# EAGLE design untitled (EAGLE 6.5.0)
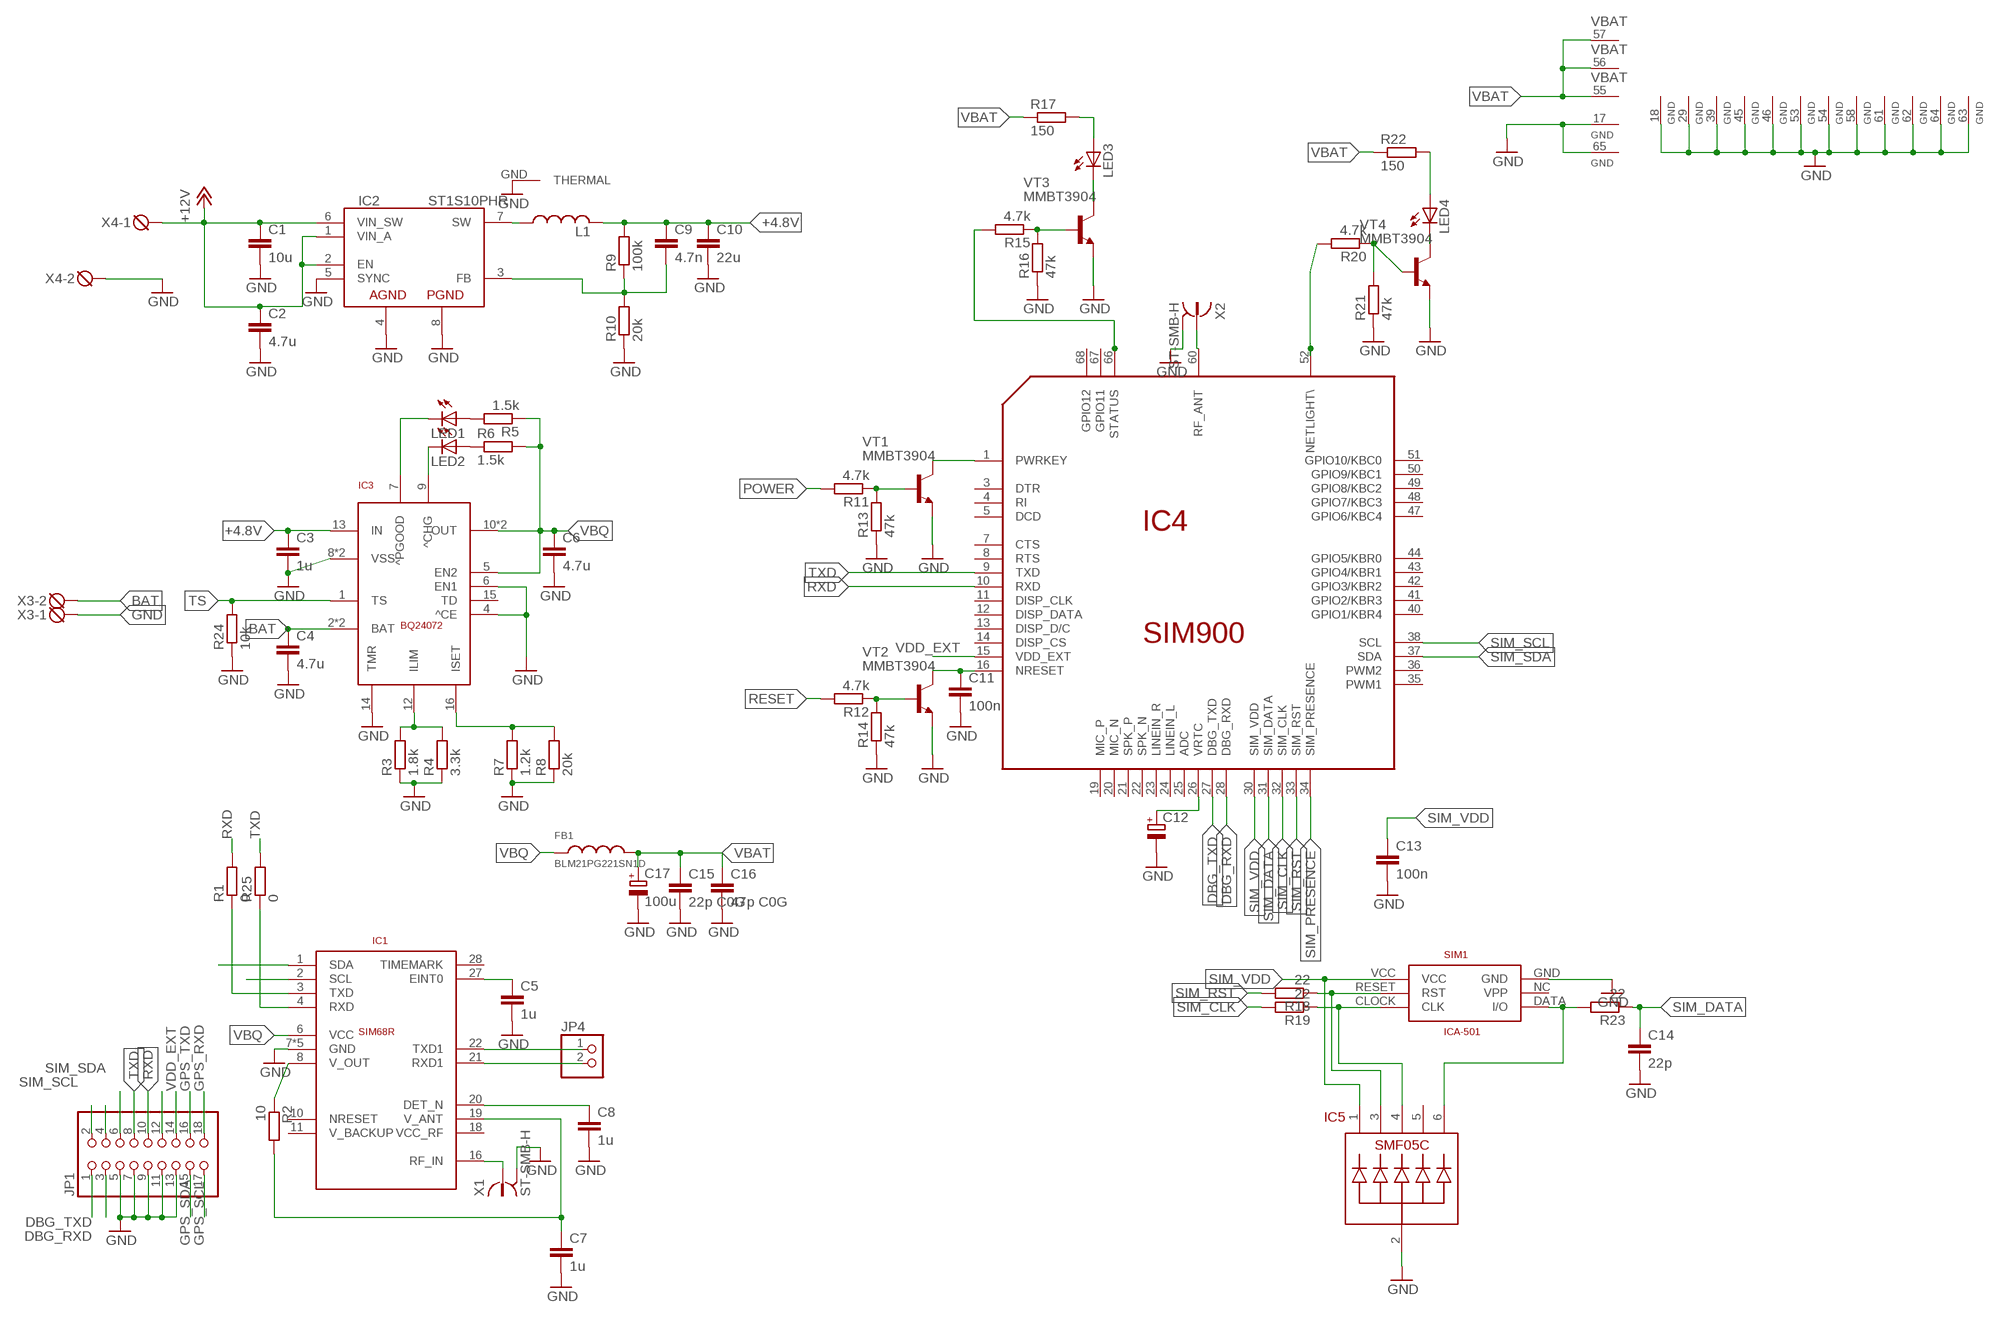
[diagram p0: schematic, sheet 1]

## Parts
C1  10u  C-EUC0805  [C0805]
C2  4.7u  C-EUC0805  [C0805]
C3  1u  C-EUC0805  [C0805]
C4  4.7u  C-EUC0805  [C0805]
C5  1u  C-EUC0805  [C0805]
C6  4.7u  C-EUC0805  [C0805]
C7  1u  C-EUC0805  [C0805]
C8  1u  C-EUC0805  [C0805]
C9  4.7n  C-EUC0805  [C0805]
C10  22u  C-EUC0805  [C0805]
C11  100n  C-EUC0805  [C0805]
C12  CPOL-EUA/3216-18R  [A/3216-18R]
C13  100n  C-EUC0805  [C0805]
C14  22p  C-EUC0805  [C0805]
C15  22p C0G  C-EUC0805  [C0805]
C16  47p C0G  C-EUC0805  [C0805]
C17  100u  CPOL-EUB/3528-21W  [B/3528-21W]
FB1  BLM21PG221SN1D  BLM21PG221  [R0805]
IC1  SIM68R  [SIM68]
IC2  ST1S10PHR  [HSOP8]
IC3  BQ24072  [QFN16]
IC4  SIM900  [SIM900]
IC5  SMF05C  [SC-70-6]
JP1  PINHD-2X9  [2X09]
JP4  PINHD-1X2ROUND  [1X02ROUND]
L1  INDUCTOR-SUMIDA-CDRH4D18  [INDUCTOR-SUMIDA-CDRH4D18]
LED1  LED0805  [SML0805]
LED2  LED0805  [SML0805]
LED3  LED0805  [SML0805]
LED4  LED0805  [SML0805]
R1  0  R-EU_R0805  [R0805]
R2  10  R-EU_R0805  [R0805]
R3  1.8k  R-EU_R0805  [R0805]
R4  3.3k  R-EU_R0805  [R0805]
R5  1.5k  R-EU_R0603  [R0603]
R6  1.5k  R-EU_R0603  [R0603]
R7  1.2k  R-EU_R0603  [R0603]
R8  20k  R-EU_R0805  [R0805]
R9  100k  R-EU_R0805  [R0805]
R10  20k  R-EU_R0805  [R0805]
R11  4.7k  R-EU_R0805  [R0805]
R12  4.7k  R-EU_R0805  [R0805]
R13  47k  R-EU_R0805  [R0805]
R14  47k  R-EU_R0805  [R0805]
R15  4.7k  R-EU_R0805  [R0805]
R16  47k  R-EU_R0805  [R0805]
R17  150  R-EU_R0805  [R0805]
R18  22  R-EU_R0805  [R0805]
R19  22  R-EU_R0805  [R0805]
R20  4.7k  R-EU_R0805  [R0805]
R21  47k  R-EU_R0805  [R0805]
R22  150  R-EU_R0805  [R0805]
R23  22  R-EU_R0805  [R0805]
R24  10k  R-EU_R0805  [R0805]
R25  0  R-EU_R0805  [R0805]
SIM1  ICA-501  [ICA-501-006-F7]
VT1  MMBT3904  [SOT23-BCE]
VT2  MMBT3904  [SOT23-BCE]
VT3  MMBT3904  [SOT23-BCE]
VT4  MMBT3904  [SOT23-BCE]
X1  ST-SMB-H  [ST-SMB-H]
X2  ST-SMB-H  [ST-SMB-H]
X3  DG3XX-02-5.0  [DG306-5.0-02P]
X4  DG3XX-02-5.0  [DG306-5.0-02P]

## Nets
+4.8V: C3.1 C9.1 C10.1 IC3.13(IN) L1.P$2 R9.2
+12V: C1.1 C2.1 IC2.1(VIN_A) IC2.2(EN) IC2.6(VIN_SW) X4.1
BAT: C4.1 IC3.2(BAT) IC3.3(BAT) X3.2
DBG_RXD: IC4.28(DBG_RXD) JP1.3
DBG_TXD: IC4.27(DBG_TXD) JP1.1
GND: C1.2 C2.2 C3.2 C4.2 C5.2 C6.2 C7.2 C8.2 C10.2 C11.2 C12.- C13.2 C14.2 C15.2 C16.2 C17.- IC1.7(GND) IC1.13(GND) IC1.14(GND) IC1.15(GND) IC1.17(GND) IC2.4(AGND) IC2.5(SYNC) IC2.8(PGND) IC2.GND(THERMAL) IC3.4(^CE) IC3.6(EN1) IC3.8(VSS) IC3.14(TMR) IC3.TH(VSS) IC4.17(GND) IC4.18(GND) IC4.29(GND) IC4.39(GND) IC4.45(GND) IC4.46(GND) IC4.53(GND) IC4.54(GND) IC4.58(GND) IC4.61(GND) IC4.62(GND) IC4.63(GND) IC4.64(GND) IC4.65(GND) IC5.2 JP1.5 JP1.7 JP1.9 JP1.11 JP1.13 R3.1 R4.1 R7.1 R8.1 R10.1 R13.1 R14.1 R16.1 R21.1 R24.1 SIM1.GND VT1.E VT2.E VT3.E VT4.E X1.2 X1.3 X1.4 X1.5 X2.2 X2.3 X2.4 X2.5 X3.1 X4.2
GPS_RXD: IC1.4(RXD) JP1.18 R25.1
GPS_SCL: IC1.2(SCL) JP1.17
GPS_SDA: IC1.1(SDA) JP1.15
GPS_TXD: IC1.3(TXD) JP1.16 R1.1
N$1: IC2.7(SW) L1.P$1
N$2: C11.1 IC4.16(NRESET) VT2.C
N$3: C9.2 IC2.3(FB) R9.1 R10.2
N$4: LED2.A R6.1
N$5: IC3.16(ISET) R7.2 R8.2
N$6: IC3.12(ILIM) R3.2 R4.2
N$7: LED1.A R5.2
N$8: IC3.9(^CHG) LED2.C
N$9: IC3.7(^PGOOD) LED1.C
N$10: IC4.1(PWRKEY) VT1.C
N$11: R11.1 R13.2 VT1.B
N$12: R12.1 R14.2 VT2.B
N$13: IC4.60(RF_ANT) X2.1
N$14: IC5.3 R18.1 SIM1.RESET(RST)
N$15: IC5.6 R23.2 SIM1.DATA(I/O)
N$16: LED4.C VT4.C
N$17: C12.+ IC4.26(VRTC)
N$18: IC5.4 R19.1 SIM1.CLOCK(CLK)
N$19: R20.1 R21.2 VT4.B
N$20: IC4.52(NETLIGHT\) R20.2
N$22: IC1.8(V_OUT) R2.1
N$23: C7.1 IC1.19(V_ANT) R2.2
N$24: IC1.16(RF_IN) X1.1
N$25: IC1.22(TXD1) JP4.1
N$26: C8.1 IC1.20(DET_N)
N$27: C5.1 IC1.27(EINT0)
N$32: IC1.21(RXD1) JP4.2
N$35: R15.1 R16.2 VT3.B
N$36: LED3.A R17.2
N$37: LED3.C VT3.C
N$38: IC4.66(STATUS) R15.2
N$45: LED4.A R22.2
POWER: JP1.12 R11.2
RESET: JP1.6 R12.2
RXD: IC4.10(RXD) JP1.10 R1.2
SIM_CLK: IC4.32(SIM_CLK) R19.2
SIM_DATA: C14.1 IC4.31(SIM_DATA) R23.1
SIM_PRESENCE: IC4.34(SIM_PRESENCE)
SIM_RST: IC4.33(SIM_RST) R18.2
SIM_SCL: IC4.38(SCL) JP1.2
SIM_SDA: IC4.37(SDA) JP1.4
SIM_VDD: C13.1 IC4.30(SIM_VDD) IC5.1 SIM1.VCC
TS: IC3.1(TS) R24.2
TXD: IC4.9(TXD) JP1.8 R25.2
VBAT: C15.1 C16.1 C17.+ FB1.2 IC4.55(VBAT) IC4.56(VBAT) IC4.57(VBAT) R17.1 R22.1
VBQ: C6.1 FB1.1 IC1.6(VCC) IC3.5(EN2) IC3.10(OUT) IC3.11(OUT) R5.1 R6.2
VDD_EXT: IC4.15(VDD_EXT) JP1.14
Unconnected: IC1.10(NRESET) IC1.11(V_BACKUP) IC1.18(VCC_RF) IC1.28(TIMEMARK) IC3.15(TD) IC4.3(DTR) IC4.4(RI) IC4.5(DCD) IC4.7(CTS) IC4.8(RTS) IC4.11(DISP_CLK) IC4.12(DISP_DATA) IC4.13(DISP_D/C) IC4.14(DISP_CS) IC4.19(MIC_P) IC4.20(MIC_N) IC4.21(SPK_P) IC4.22(SPK_N) IC4.23(LINEIN_R) IC4.24(LINEIN_L) IC4.25(ADC) IC4.35(PWM1) IC4.36(PWM2) IC4.40(GPIO1/KBR4) IC4.41(GPIO2/KBR3) IC4.42(GPIO3/KBR2) IC4.43(GPIO4/KBR1) IC4.44(GPIO5/KBR0) IC4.47(GPIO6/KBC4) IC4.48(GPIO7/KBC3) IC4.49(GPIO8/KBC2) IC4.50(GPIO9/KBC1) IC4.51(GPIO10/KBC0) IC4.67(GPIO11) IC4.68(GPIO12) IC5.5 SIM1.NC(VPP)

## Power pins joined to a net without a drawn wire
GND: IC4.59(GND)

## Library data of the parts
C1-C11 C13-C16 = resistor:C-EU: CAPACITOR, European symbol
C12 C17 = rcl:CPOL-EU: POLARIZED CAPACITOR, European symbol
FB1 = murata-ferrite:BLM21PG221
IC1 = sim68:SIM68R
IC2 = vreg-pulse (1):ST1S10: 3 A, 900 kHz, monolithic synchronous step-down regulator
IC3 = TI-bq24075:BQ24072
IC4 = sim900R:SIM900
IC5 = smf05c:SMF05C
JP1 = pinhead:PINHD-2X9: PIN HEADER
JP4 = pinhead:PINHD-1X2: PIN HEADER
L1 = CDRH6D38:INDUCTOR-SUMIDA-CDRH4D18
LED1-LED4 = LED0805:LED0805
R1-R25 = rcl:R-EU_: RESISTOR, European symbol
SIM1 = ICA-501:ICA-501
VT1-VT4 = transistor-npn:MMBT3904
X1 X2 = coaxCon:ST-SMB-H: MALE SMB CONNECTOR Radiall distributor RS 193-8861887; OC_FARNELL: unknown; OC_NEWARK: unknown
X3 X4 = degson:DG3XX-02: DG350-3.5-02P DG306-5.0-02P

## Board
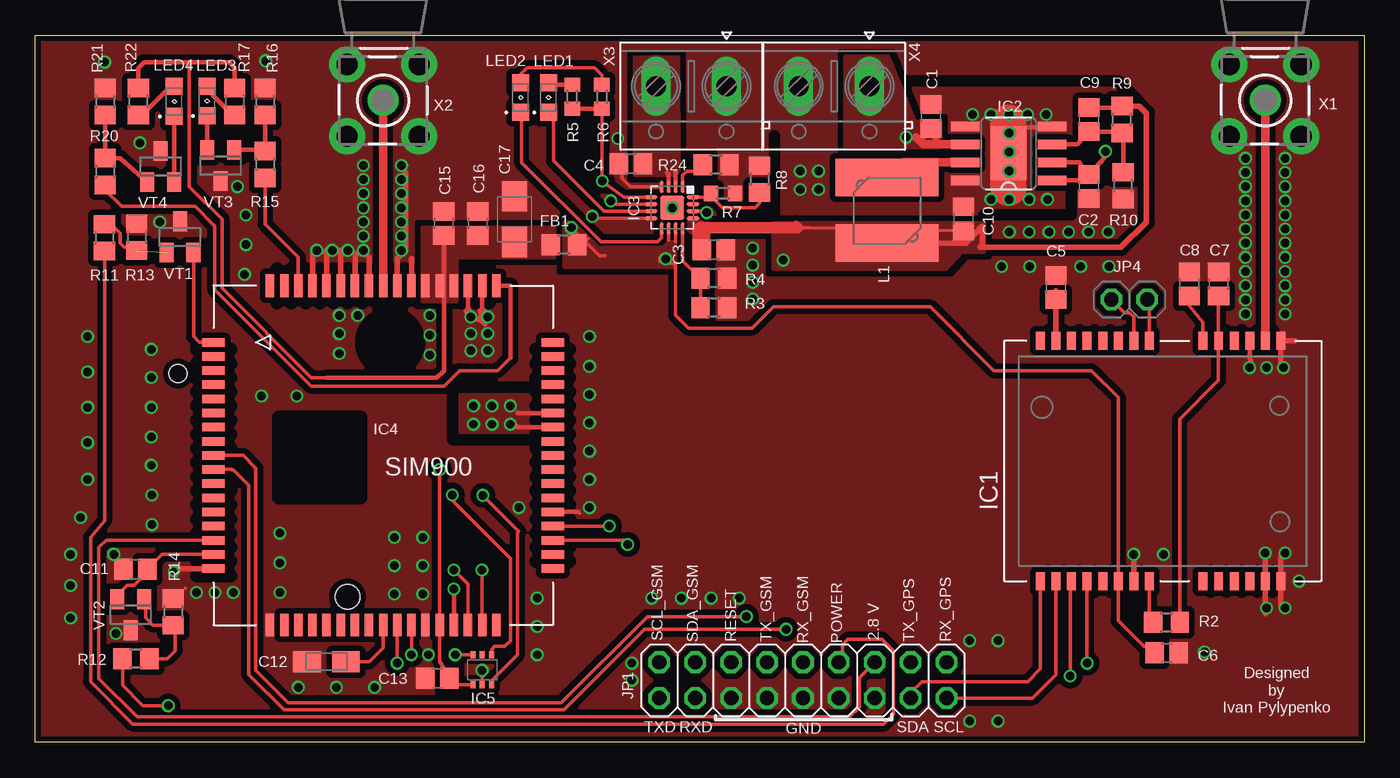
[diagram p1: board, top side]
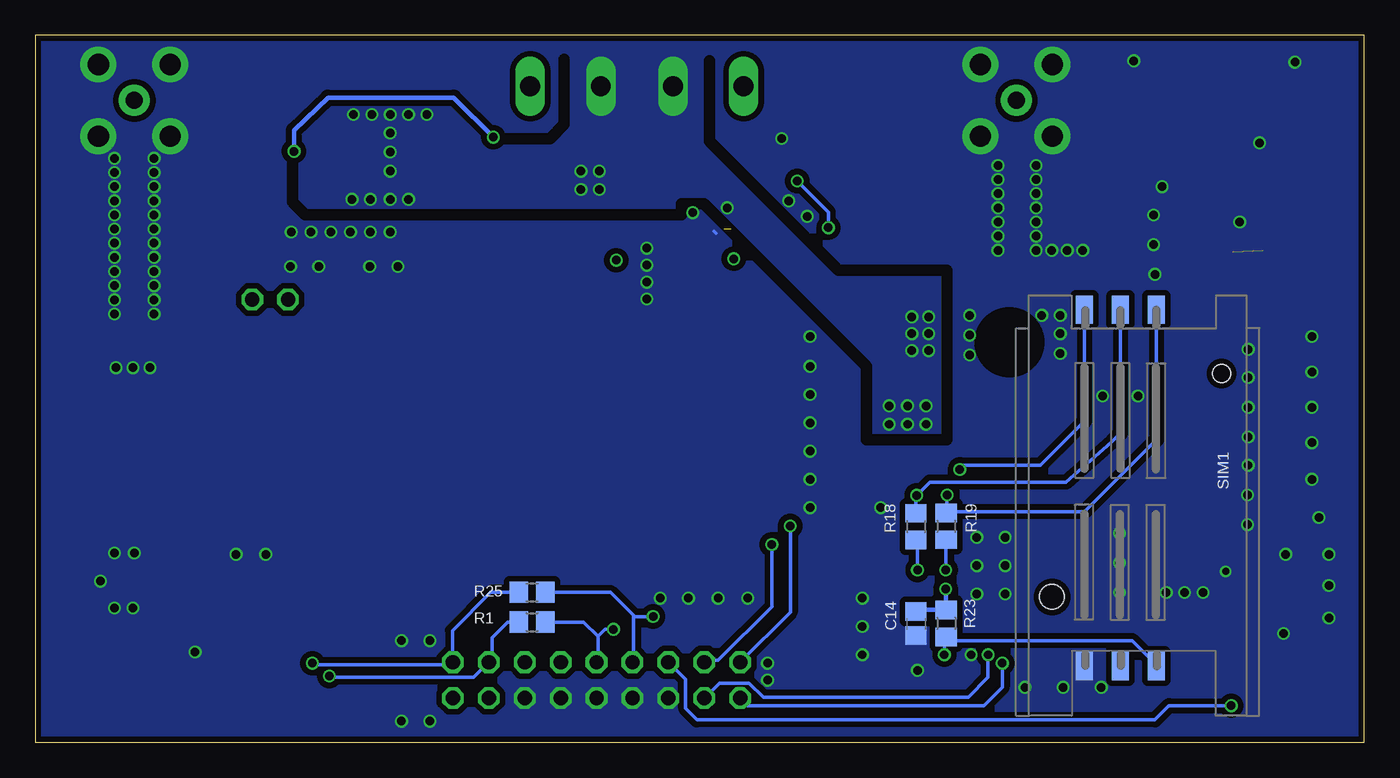
[diagram p2: board, bottom side, seen from below]

Size 94 x 50 mm. Coordinates in mm from the lower left corner, seen from the top.
Outline: 0,0 0,50 94,50 94,0 0,0
Copper layers (1*16): Top 0.035mm / dielectric 1.5mm / Bottom 0.035mm
Design rules "ITEADstudio_DRC": minimum track width 6mil, minimum drill 12mil, track to track 6mil, track to pad 6mil, pad to pad 6mil, via to via 6mil, smd to smd 0mil, copper to edge 10mil, drill to drill 10mil, minimum pad ring 10mil, minimum via ring 6mil, stop-mask expansion 2mil, vias tented up to drill 100mil, thermal gap 10mil
tRestrict: 8 lines
bRestrict: 16 lines

### Footprints (pad centres in the part's own frame; a part is rotated, then mirrored left to right if it is on the bottom)
C0805 = smd 1.3 x 1.5: 1 -0.85,0; 2 0.85,0
A/3216-18R = smd 1.95 x 1.5: + 1.375,0; - -1.375,0
B/3528-21W = smd 2.15 x 1.8: + 1.625,0; - -1.625,0
R0805 = smd 1.3 x 1.5: 1 -0.95,0; 2 0.95,0
SIM68 = smd 1.27 x 0.635: 1 0,0; 2 0,-1.1; 3 0,-2.2; 4 0,-3.3; 5 0,-4.4; 6 0,-5.5; 7 0,-6.6; 8 0,-7.7; 9 0,-11.5; 10 0,-12.6; 11 0,-13.7; 12 0,-14.8; 13 0,-15.9; 14 0,-17; 15 17,-17; 16 17,-15.9; 17 17,-14.8; 18 17,-13.7; 19 17,-12.6; 20 17,-11.5; 21 17,-7.7; 22 17,-6.6; 23 17,-5.5; 24 17,-4.4; 25 17,-3.3; 26 17,-2.2; 27 17,-1.1; 28 17,0
HSOP8 = smd 0.66 x 2.032: 1 -1.905,-3.073; 2 -0.635,-3.073; 3 0.635,-3.073; 4 1.905,-3.073; 5 1.905,3.073; 6 0.635,3.073; 7 -0.635,3.073; 8 -1.905,3.073 | smd 3.81 x 2.54: GND 0,0
QFN16 = smd 0.85 x 0.28: 1 -1.475,0.75; 2 -1.475,0.25; 3 -1.475,-0.25; 4 -1.475,-0.75; 9 1.475,-0.75; 10 1.475,-0.25; 11 1.475,0.25; 12 1.475,0.75 | smd 0.28 x 0.85: 5 -0.75,-1.475; 6 -0.25,-1.475; 7 0.25,-1.475; 8 0.75,-1.475; 13 0.75,1.475; 14 0.25,1.475; 15 -0.25,1.475; 16 -0.75,1.475 | smd 1.7 x 1.7: TH 0,0
SIM900 = smd 1.6 x 0.6: 1 -12,8; 2 -12,7; 3 -12,6; 4 -12,5; 5 -12,4; 6 -12,3; 7 -12,2; 8 -12,1; 9 -12,0; 10 -12,-1; 11 -12,-2; 12 -12,-3; 13 -12,-4; 14 -12,-5; 15 -12,-6; 16 -12,-7; 17 -12,-8; 35 12,-8; 36 12,-7; 37 12,-6; 38 12,-5; 39 12,-4; 40 12,-3; 41 12,-2; 42 12,-1; 43 12,0; 44 12,1; 45 12,2; 46 12,3; 47 12,4; 48 12,5; 49 12,6; 50 12,7; 51 12,8 | smd 0.6 x 1.6: 18 -8,-12; 19 -7,-12; 20 -6,-12; 21 -5,-12; 22 -4,-12; 23 -3,-12; 24 -2,-12; 25 -1,-12; 26 0,-12; 27 1,-12; 28 2,-12; 29 3,-12; 30 4,-12; 31 5,-12; 32 6,-12; 33 7,-12; 34 8,-12; 52 8,12; 53 7,12; 54 6,12; 55 5,12; 56 4,12; 57 3,12; 58 2,12; 59 1,12; 60 0,12; 61 -1,12; 62 -2,12; 63 -3,12; 64 -4,12; 65 -5,12; 66 -6,12; 67 -7,12; 68 -8,12
SC-70-6 = smd 0.35 x 0.5: 1 -0.65,-1.05; 2 0,-1.05; 3 0.65,-1.05; 4 0.65,1.05; 5 0,1.05; 6 -0.65,1.05
2X09 = drill 1.016 octagon: 1 -10.16,-1.27; 2 -10.16,1.27; 3 -7.62,-1.27; 4 -7.62,1.27; 5 -5.08,-1.27; 6 -5.08,1.27; 7 -2.54,-1.27; 8 -2.54,1.27; 9 0,-1.27; 10 0,1.27; 11 2.54,-1.27; 12 2.54,1.27; 13 5.08,-1.27; 14 5.08,1.27; 15 7.62,-1.27; 16 7.62,1.27; 17 10.16,-1.27; 18 10.16,1.27
1X02ROUND = drill 1.016 octagon: 1 -1.27,0; 2 1.27,0
INDUCTOR-SUMIDA-CDRH4D18 = smd 7.3 x 2.65: P$1 0,-2.325; P$2 0,2.325
SML0805 = smd 1.2 x 1.2: A 1.05,0; C -1.05,0
R0603 = smd 1 x 1.1: 1 -0.85,0; 2 0.85,0
ICA-501-006-F7 = smd 2 x 1.2: CLOCK 0,0; DATA 25.2,0; GND 25.2,-5.08; NC 25.2,-2.54; RESET 0,-2.54; VCC 0,-5.08 | hole 1.3: 4.51,4.61 | hole 1.75: 20.31,-7.38
SOT23-BCE = smd 1 x 1.4: B -0.95,-1.1; C 0.95,-1.1; E 0,1.1
ST-SMB-H = drill 1.2 pad 2.184: 1 0,0 | drill 1.5 pad 2.54: 2 -2.54,2.54; 3 2.54,2.54; 4 2.54,-2.54; 5 -2.54,-2.54
DG306-5.0-02P = drill 1.4 long: 1 -2.5,0; 2 2.5,0

### Placement (x,y rotation side)
C1  63.36,44.27 90 top
C2  74.53,39.31 270 top
C3  48,34.84 0 top
C4  42.13,40.92 180 top
C5  72.19,32.17 90 top
C6  80.03,6.33 0 top
C7  83.69,32.41 90 top
C8  81.63,32.41 90 top
C9  74.53,44.05 270 top
C10  65.65,37.03 90 top
C11  7.08,12.25 180 top
C12  20.6,5.7 0 top
C13  28.44,4.54 180 top
C14  31.7,8.4 270 bottom
C15  28.9,36.7 90 top
C16  31.3,36.7 90 top
C17  33.9,37 270 top
FB1  37.4,35.2 180 top
IC1  71.1,11.4 90 top
IC2  68.85,41.65 90 top
IC3  45.05,37.82 270 top
IC4  24.61,20.3 0 top
IC5  31.61,5.14 0 top
JP1  54.3,4.4 0 top
JP4  77.39,31.32 0 top
L1  60.25,37.63 180 top
LED1  36.29,45.61 90 top
LED2  34.32,45.61 90 top
LED3  12.14,45.36 90 top
LED4  9.81,45.34 90 top
R1  58.86,8.51 0 bottom
R2  80.01,8.49 0 top
R3  48.01,30.74 180 top
R4  48,32.81 180 top
R5  37.98,45.66 90 top
R6  40.08,45.66 270 top
R7  48.65,38.83 180 top
R8  51.23,39.83 270 top
R9  76.87,44.05 90 top
R10  76.95,39.37 90 top
R11  4.89,35.69 270 top
R12  7.11,5.92 180 top
R13  7.17,35.73 270 top
R14  9.76,9.24 270 top
R15  16.25,40.88 270 top
R16  16.25,45.33 270 top
R17  14.1,45.33 270 top
R18  31.7,15.26 270 bottom
R19  29.57,15.29 270 bottom
R20  4.94,40.38 270 top
R21  4.93,45.33 270 top
R22  7.29,45.33 270 top
R23  29.57,8.41 270 bottom
R24  48.15,40.85 180 top
R25  58.86,10.61 0 bottom
SIM1  14.7,30.6 270 bottom
VT1  10.23,35.74 0 top
VT2  6.75,9.03 180 top
VT3  13.11,40.8 180 top
VT4  8.87,40.73 0 top
X1  87,45.4 90 top
X2  24.6,45.4 90 top
X3  46.4,46.4 180 top
X4  56.5,46.4 180 top

### Tracks (layer width: path | path; a pad name or v marks a point on that pad's centre or on a via)
+4.8V  (via drill 0.6)
  Top 0.254: 53.8,36.7 54.1,36.4 54.73,36.4 C10.1
  Top 0.305: C9.1 76.45,44.9 R9.2
  Top 0.406: 47.5,36.4 47.1,36.2 | 47.1,35.14 C3.1 | 53.8,36.7 53.9,36.4 | L1.P$2 65.81,35.31 67,36.5 67,35.2 66.8,35 76.8,35 78.6,36.8 78.6,44.5 78.1,45 R9.2
  Top 0.813: 53.9,36.4 47.5,36.4
  Top 1.27: 47.1,36.2 47.1,35.14
  other vias: 52.9,34.1
  pour Top (no thermals): 52.2,33.5 64.4,33.5 65.5,34.7 67.1,34.7 67.1,36.7 52.2,36.7
  pour Top (no thermals): 46.25,37.1 46.25,36.2 46.6,35.85 47.65,35.85 47.65,36.75 47.25,37.1
+12V  (via drill 0.6)
  Top 0.305: IC2.1 74.03,39.74 C2.1 | IC2.2 73.84,41.02 C2.1 | C2.1 74.61,40.28 74.7,40.2 | v61.6,42.8 62.3,42.8 62.84,42.8 C1.1 | v75.7,41.8 75.7,41.42 C2.1
  Top 0.406: 63.89,42.28 C1.1 | 74.7,40.2 74.6,40.2
  Top 0.61: IC2.6 62.81,42.28 62.3,42.8
  Bottom 0.305: v75.7,41.8 75.7,43.3 73.3,45.6 64.4,45.6 v61.6,42.8
  pour Top (no thermals): 64,42.1 57.3,42.1 57.3,48.5 60.3,48.5 62.2,43.9 64,43.9
BAT
  Top 0.305: IC3.3 44.8,40.2 44.7,40.3 | IC3.2 45.3,40.4
  pour Top (no thermals): 42.4,40.1 45.3,40.1 45.55,40.5 45.55,40.75 45.5,48.45 42.4,48.45
DBG_RXD  (via drill 0.6)
  Top 0.254: IC4.28 v26.61,6.21 v26.6,6.2
  Bottom 0.254: JP1.3 45.61,4.2 43.5,4.2 42.5,3.2 28,3.2 26.6,4.6 v26.6,6.2
DBG_TXD  (via drill 0.6)
  Top 0.254: IC4.27 v25.61,5.61 v25.6,5.6
  Bottom 0.254: v25.6,5.6 25.6,3.9 26.9,2.6 43.61,2.6 JP1.1
GND  (via drill 0.5, 0.6)
  Top 0.254: 47.5,37.6 47.47,37.57 v47.5,37.47 47.6,37.57 IC3.14 | IC3.4 42.11,39.29 41.5,39.9 41.5,40.84 C4.2 | IC3.8 39.93,37.07 v39.4,37.2 | IC3.6 40.93,38.07 v40.7,38.3 | 38.41,16.3 38.5,16.2 | IC5.2 31.61,4.92 31.9,5.2 | C12.- 19.48,5.7 SIM1.GND | 10.61,10.89 arc-45 10.6,10.9
  Top 0.305: 31.5,29.9 31,29.9 v30.8,30.1 30.61,30.3 IC4.54 | 71,43.5 69.1,43.5 68.9,43.7 | IC1.17 85.9,27.1 86,27 | IC4.46 34.1,23.3 | IC4.45 34.1,22.3 34,22.4 | IC4.53 31.61,30.5 | IC4.39 38.41,16.3
  Top 0.406: IC4.58 26.61,34.2 | 77.7,12.3 IC1.7 77.7,13.1 77.6,13.2 | 31.61,30.2 31.5,30.1 31.5,29.9 31.8,29.6 | IC4.65 19.61,34.51 19.8,34.7 20.61,34.7 | IC4.64 20.61,34.7 | 20.61,34.7 20.61,34.8 20.6,34.8 | IC4.63 21.61,34.7 21.5,34.8 | IC4.62 22.61,34.59 | 22.61,34.59 22.6,34.6 | IC4.59 25.61,34.2 26.2,34.8 26.2,40.32 | IC4.61 23.61,34.3 23.3,34.6 22.61,34.6 22.61,34.59 | 87,13.3 IC1.13 87,9.1 | 88.1,13.1 IC1.14 88.1,9.6 | 71,43.5 71.87,43.5 IC2.4 | 88,26.5 88.1,26.6 IC1.15 89.1,28.4 | IC4.17 9.8,12.29 v9.8,12.1
  Top 0.61: 30.61,30.5 v30.8,30.1 | 31.61,30.5 v32,30.1
  Top 2.54: 68.85,39.2 68.85,43.85
  Bottom 0.254: 45.85,36 46,36.15 | v40.7,38.3 40.6,38.3 40.5,38.4
  other vias: 8.25,17.5 8.25,15.4 68.9,40.4 68.9,41.75 68.9,43.1 17.3,14.8 11.4,10.6 17.3,12.7 14,10.6 12.7,10.6 77.7,13.3 27.4,12.5 25.4,12.5 25.4,10.5 27.4,10.5 8.2,25.8 8.2,23.7 8.2,21.6 8.2,19.6 8.2,27.8 50.75,34.95 50.75,33.75 39.2,18.6 39.2,20.6 67.6,38.4 68.9,38.4 45.05,37.8 68.9,36.1 70.3,36.1 71.7,36.1 73.1,36.1 74.5,36.1 75.9,36.1 70.3,38.4 68.9,44.4 67.6,44.4 70.2,44.4 30.8,28.9 32,28.9 55.4,39.1 71.6,38.4 55.4,40.4 7.4,42.4 14.9,35.2 14.9,37.3 14.8,33.1 41.2,42.7 31,22.5 32.3,22.5 33.6,22.5 33.6,23.8 32.3,23.8 31,23.8 30.8,27.7 32,27.7 23.2,34.8 23.2,35.8 23.2,36.8 23.2,37.8 23.2,38.8 25.9,34.8 25.9,35.8 25.9,36.8 25.9,37.8 25.9,38.8 22.1,34.8 21,34.8 19.9,34.8 8.8,36.8 5.7,7.7 31.6,5.1 27.8,6.2 50.75,32.55 50.75,31.35 85.6,40.3 85.6,41.3 85.6,35.3 85.6,36.3 85.6,37.3 85.6,38.3 85.6,39.3 85.6,30.3 85.6,31.3 85.6,32.3 85.6,33.3 85.6,34.3 88.4,40.3 88.4,41.3 88.4,35.3 88.4,36.3 88.4,37.3 88.4,38.3 88.4,39.3 88.4,30.3 88.4,31.3 88.4,32.3 88.4,33.3 88.4,34.3 88.4,9.5 88.4,13.4 87,13.4 79.8,13.3 85.9,26.5 87.1,26.5 88.3,26.5 23.2,39.8 23.2,40.8 25.9,39.8 25.9,40.8 39.2,16.6 34.2,16.6 35.5,6.2 35.5,8.2 35.5,10.2 17.3,10.6 87.1,9.5 5.55,13.3 3.7,26.2 3.7,23.7 3.7,18.6 3.7,21.2 3.2,15.9 2.5,13.3 2.5,11.1 2.5,8.8 54.1,40.4 54.1,39.1 66.3,44.4 71.5,44.4 18.6,3.9 21.3,3.9 24,3.9 39.2,22.6 39.2,24.6 39.2,26.6 39.2,28.7 82.7,6.4 4.9,48.1 16.3,48.2 14.3,39.3 66.1,7.2 68.1,7.2 43.6,10.2 45.7,10.2 47.8,10.2 49.8,10.2 68.1,1.5 66.1,1.5 70.35,33.65 68.35,33.65 73.95,33.65 75.95,33.65 21.5,30.2 27.9,30.2 16,24.5 18.5,24.5 3.7,28.7 89.4,11.4 42.2,5.6 42.2,4.4 22.8,30.2 21.5,28.9 21.5,27.5 27.9,27.4 27.9,28.8 25.4,14.5 27.4,14.5
  pour Top (isolate 0.406, rank 4, no thermals): 0,0 0,50.6 95.2,50.7 95.2,0
  pour Bottom (isolate 0.406, rank 4, no thermals): 0,0 0,50.6 95.2,50.7 95.2,0
  pour Top: 26,34.5 26,40.4 26.1,40.8 26.6,40.8 26.6,34.5
GPS_RXD  (via drill 0.6)
  Top 0.254: v74.4,5.6 IC1.4
  Bottom 0.254: R25.1 61.79,10.61 64.5,7.9 64.5,5.71 | 64.5,5.71 JP1.18 | 64.5,5.71 64.5,5.6 64.6,5.5 74.3,5.5 v74.4,5.6
GPS_SCL
  Top 0.254: JP1.17 70.53,3.13 72.2,4.8 IC1.2
GPS_SDA
  Top 0.254: JP1.15 61.92,3.52 62.7,4.3 70.2,4.3 71.1,5.2 IC1.1
GPS_TXD  (via drill 0.6)
  Top 0.254: v73.2,4.7 73.2,11.3 IC1.3
  Top 0.305: 73.4,11.5 IC1.3
  Bottom 0.254: R1.1 60.59,8.51 61.7,7.4 61.7,5.9 | 61.7,5.9 61.7,5.89 JP1.16 | 61.7,5.9 63,4.6 73.1,4.6 v73.2,4.7
N$1
  Top 0.61: IC2.7 61.43,41.02 L1.P$1
N$2
  Top 0.254: 8.29,11.89 C11.1 | VT2.C 5.8,10.2 5.88,10.2 5.88,10.48 6.5,11.1 7,11.1 7.5,11.6 7.5,11.81 C11.1 | IC4.16 8.98,13.29 C11.1
N$3
  Top 0.305: IC2.3 73.72,42.28 C9.2 76.55,43.2 R9.1 76.95,43.09 R10.2
N$4
  Top 0.254: R6.1 40.08,47.17 39.55,47.7 34.8,47.7 34.3,47.2 34.3,46.68 LED2.A
N$5
  Top 0.254: R8.2 51.23,38.13 50.9,37.8 48.6,37.8 48.1,38.3 48.1,38.53 R7.2 47.53,38.57 IC3.16
N$6
  Top 0.254: IC3.12 45.8,34.07 R4.2 R3.2
N$7
  Top 0.305: R5.2 36.44,46.51 LED1.A
N$8
  Top 0.254: IC3.9 44.3,35.7 44,35.4 40,35.4 34.4,41 34.4,44.48 LED2.C
N$9
  Top 0.254: LED1.C 36.65,44.2 36.65,41.15 40.23,37.57 IC3.7
N$10
  Top 0.254: VT1.C 11.19,28.71 11.6,28.3 IC4.1
N$11  (1 unrouted)
  Top 0.254: R11.1 5.36,36.64 6,36 6,35.3 6.3,35 6.95,35 R13.2
N$12
  Top 0.254: R12.1 9.32,5.92 9.9,6.5 9.9,8.15 R14.2 8.31,8.29 7.8,8.8 7.8,10.03 VT2.B
N$13
  Top 0.406: IC4.60
  Top 0.61: IC4.60 X2.1
N$14  (via drill 0.6)
  Top 0.254: 31.68,17.5 v31.65,17.48 34.2,14.93 34.1,14.83 34.1,6.2 32.27,4.37 IC5.3
  Bottom 0.254: R18.1 31.7,17.43 v31.65,17.48 30.73,18.4 21.1,18.4 17.84,21.26 17.24,21.86 SIM1.RESET
N$15  (via drill 0.6)
  Top 0.254: IC5.6 v29.7,6.2
  Bottom 0.254: SIM1.DATA 15.3,6.1 16.4,7.2 29.3,7.2 R23.2 29.7,7.33 v29.7,6.2
N$16
  Top 0.305: VT4.C LED4.C
N$17
  Top 0.254: IC4.26 24.61,6.71 23.6,5.7 C12.+
N$18  (via drill 0.6)
  Top 0.254: IC5.4 32.27,6.57 32.5,6.8 33.2,6.8 33.6,7.2 33.6,13 29.5,17.1 v29.5,17.5
  Bottom 0.254: 29.5,16.3 19.8,16.3 14.7,21.4 SIM1.CLOCK | 29.5,16.3 R19.1 | 29.5,16.3 v29.5,17.5
N$19
  Top 0.305: VT4.B 6.01,41.33 R20.1 R21.2
N$20
  Top 0.254: R20.2 4.94,39.06 6.1,37.9 11.3,37.9 12.63,36.57 arc-45 12.7,36.4 12.7,32 19.5,25.2 28.9,25.2 30,26.3 32.7,26.3 33.6,27.2
  Top 0.305: 33.6,27.2 33.6,32.3 IC4.52
N$22
  Top 0.254: IC1.8 78.8,8.75 R2.1
N$23
  Top 0.254: R2.2 80.96,22.86 83.7,25.6 IC1.19 C7.1
N$24
  Top 0.61: X1.1 IC1.16
N$25
  Top 0.254: IC1.22 77.7,30.1 77.4,30.4 77.04,30.4 JP4.1
N$26
  Top 0.254: C8.1 81.63,30.87 82.6,29.7 IC1.20
N$27
  Top 0.406: C5.1 72.2,31.92 IC1.27
N$32
  Top 0.254: IC1.21 78.8,30.66 JP4.2
N$35
  Top 0.305: VT3.B 16.18,41.9 R15.1 R16.2
N$36
  Top 0.305: R17.2 13.93,44.38 12.5,45.8 12.5,46.05 LED3.A
N$37
  Top 0.305: LED3.C 12.14,41.92 VT3.C
N$38
  Top 0.254: R15.2 16.25,36.65 18.6,34.3 IC4.66
N$45
  Top 0.305: LED4.A 9.59,46.38 8,44.8 7.71,44.8 R22.2
POWER
  Top 0.254: JP1.12 57.1,5.93 57.1,6.9 57.5,7.3 59.9,7.3 60.7,6.5 60.7,2 60,1.3 6.9,1.3 3.9,4.3 3.9,14.5 4.89,15.69 R11.2
RESET  (via drill 0.6)
  Top 0.254: R12.2 6.16,4.04 7.6,2.6 v9.4,2.6
  Bottom 0.254: JP1.6 48,4.45 48,2.4 47.2,1.6 14.8,1.6 13.8,2.6 v9.4,2.6
RXD  (via drill 0.6)
  Top 0.254: IC4.10 13.9,19.3 14,19.3 15.1,18.2 15.1,4.8 17.6,2.3 37.4,2.3 43.1,8 v53.1,8
  Bottom 0.254: R1.2 55.21,8.51 54.2,7.5 | 54.2,7.5 54.2,5.77 JP1.10 | v53.1,8 53.7,8 54.2,7.5
SIM_CLK  (via drill 0.6)
  Top 0.254: IC4.32 30.61,11.2 v29.6,12.2
  Bottom 0.254: v29.6,12.2 29.6,14.3 R19.2
SIM_DATA  (via drill 0.6)
  Top 0.305: IC4.31 v29.61,10.85 v29.6,10.85
  Bottom 0.305: C14.1 31.59,9.37 R23.1 29.6,9.4 v29.6,10.85
SIM_RST  (via drill 0.6)
  Top 0.254: IC4.33 v31.61,12.2 v31.6,12.2
  Bottom 0.254: v31.6,12.2 31.6,14.21 R18.2
SIM_SCL  (via drill 0.6)
  Top 0.254: IC4.38 v40.59,15.29 v40.6,15.3
  Bottom 0.254: v40.6,15.3 40.6,9.21 JP1.2
SIM_SDA  (via drill 0.6)
  Top 0.254: IC4.37 41.6,14.29 v41.9,14
  Bottom 0.254: v41.9,14 41.9,9.6 45.7,5.8 46.55,5.8 JP1.4
SIM_VDD  (via drill 0.6)
  Top 0.254: v28.6,19.3 v28.61,19.3 IC4.30 28.61,5.75 C13.1 29.73,4.09 IC5.1
  Bottom 0.254: v28.6,19.3 28.3,19.6 22.9,19.6 19.78,22.72 SIM1.VCC
TS
  Top 0.254: IC3.1 45.8,40.1 46.1,40.4 46.75,40.4 R24.2
TXD  (via drill 0.6)
  Top 0.254: IC4.9 14.71,20.3 15.6,19.4 15.6,5.1 17.9,2.8 37.2,2.8 43.3,8.9 v50.3,8.9
  Bottom 0.254: R25.2 53.31,10.61 51.7,9 51.7,8.9 | 51.7,8.9 51.7,5.73 JP1.8 | v50.3,8.9 51.7,8.9
VBAT
  Top 0.254: 20.6,25.8 19.5,25.8 13.2,32.1 13.2,37 10.9,39.3 10.9,48
  Top 0.305: 28.7,32.39 IC4.56 | R22.1 7.29,47.69 7.7,48.1 11,48.1 | 11,48.1 13.7,48.1 14.1,47.7 R17.1 | C15.1 28.9,26.3 28.4,25.8 20.6,25.8 | 10.9,48 11,48.1
  pour Top (no thermals): 27.4,31.2 27.4,36.4 36.7,36.4 36.7,34.3 29.8,34.3 29.8,31.2
VBQ  (via drill 0.6)  (1 unrouted)
  Top 0.254: C6.1 78.72,6.8 78.4,6.8 76.6,8.6 IC1.6 76.6,24.4 74.7,26.3 67.8,26.3 63.3,30.8 52.2,30.8 50.7,29.3 46.2,29.3 45.3,30.2 45.3,33.8 44.2,34 44.2,34.3 44.3,34.4 | IC3.10 44.8,35.5 | IC3.11 45.3,35.4 | R6.2 40.08,40.32 v40.1,39.7 41.63,38.57 IC3.5 | FB1.1 39.1,35.6 | 40.3,34.4 39.9,34.4 v37.9,36.4
  Top 0.305: R6.2 R5.1
  Bottom 0.254: v37.9,36.4 37.9,37.5 v40.1,39.7
  other vias: 44.6,34.2
  pour Top (no thermals): 37.4,36.8 37.4,33.6 45.3,33.6 45.3,35.4 44.8,35.4 44.4,35 40.1,35 38.4,36.8
VDD_EXT
  Top 0.254: JP1.14 58.3,4.59 58.3,2.5 57.6,1.8 7.2,1.8 4.5,4.5 4.5,13.8 5,14.3 5,14.29 IC4.15

### Text on the board
tNames: SCL_GSM | SDA_GSM | RESET | TX_GSM | RX_GSM | POWER | 2.8 V | TX_GPS | RX_GPS | Designed / by / Ivan Pylypenko | TXD | RXD | SDA | SCL | GND